# EAGLE design 07_LOAD (EAGLE 7.5.0)
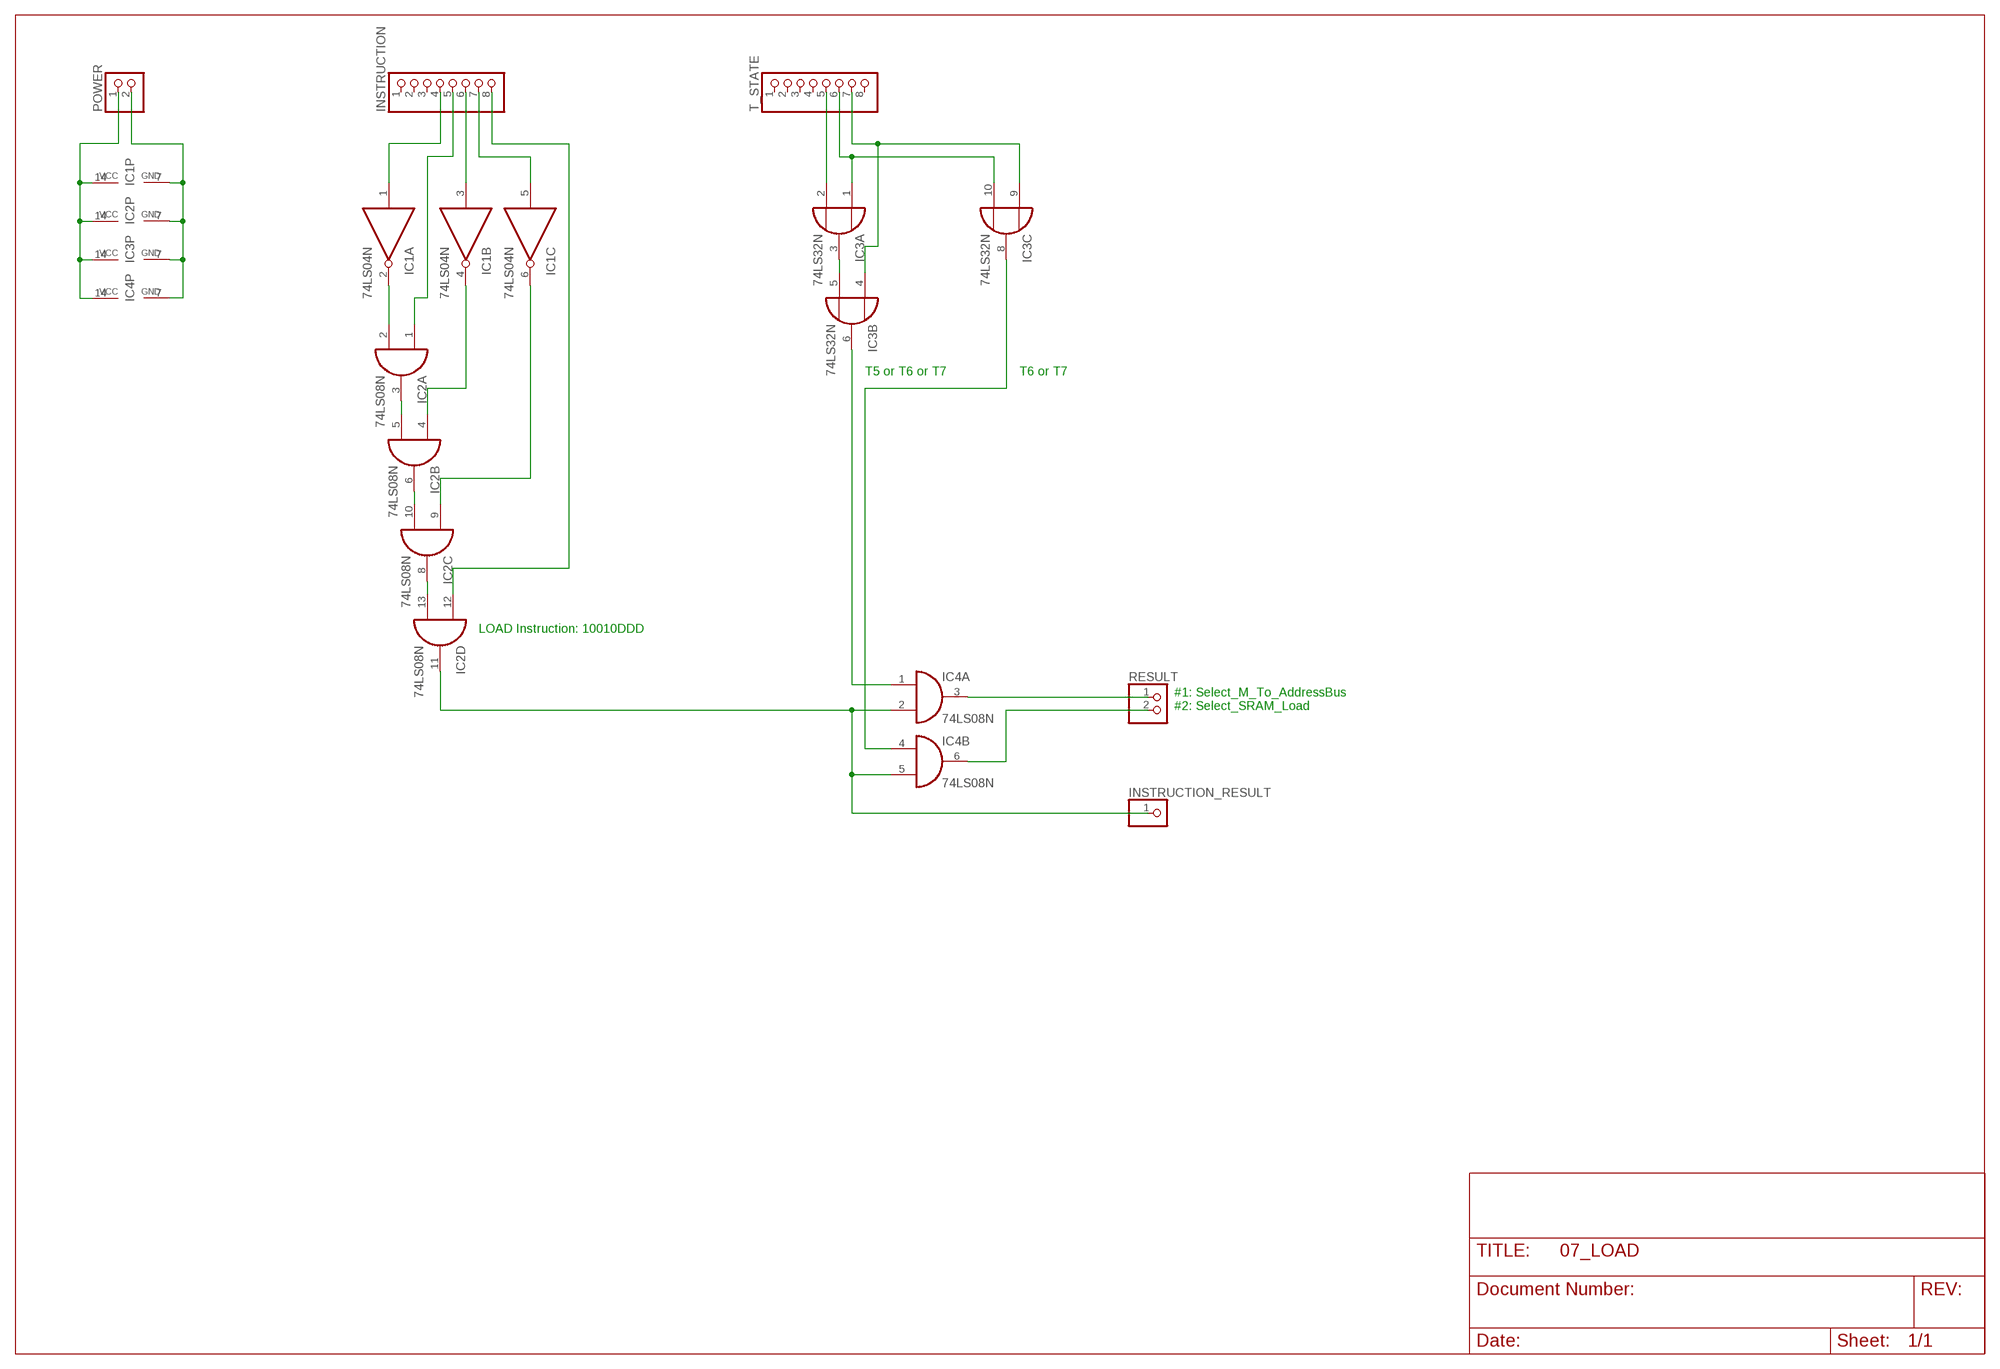
[diagram p0: schematic, sheet 1]

## Parts
IC1  74LS04N  [DIL14]
IC2  74LS08N  [DIL14]
IC3  74LS32N  [DIL14]
IC4  74LS08N  [DIL14]
INSTRUCTION  PINHD-1X8  [1X08]
INSTRUCTION_RESULT  PINHD-1X1  [1X01]
POWER  PINHD-1X2  [1X02]
RESULT  PINHD-1X2  [1X02]
T_STATE  PINHD-1X8  [1X08]

## Nets
GND: IC1.7(P:GND) IC2.7(P:GND) IC3.7(P:GND) IC4.7(P:GND) POWER.2
N$1: IC1.1(A:I) INSTRUCTION.4
N$2: IC1.3(B:I) INSTRUCTION.6
N$3: IC1.5(C:I) INSTRUCTION.7
N$4: IC1.2(A:O) IC2.2(A:I1)
N$5: IC2.1(A:I0) INSTRUCTION.5
N$6: IC2.3(A:O) IC2.5(B:I1)
N$7: IC1.4(B:O) IC2.4(B:I0)
N$8: IC2.6(B:O) IC2.10(C:I1)
N$9: IC1.6(C:O) IC2.9(C:I0)
N$10: IC2.8(C:O) IC2.13(D:I1)
N$11: IC2.12(D:I0) INSTRUCTION.8
N$12: IC3.2(A:I1) T_STATE.5
N$13: IC3.1(A:I0) IC3.10(C:I1) T_STATE.6
N$14: IC3.3(A:O) IC3.5(B:I1)
N$16: IC2.11(D:O) IC4.2(A:I1) IC4.5(B:I1) INSTRUCTION_RESULT.1
N$17: IC3.6(B:O) IC4.1(A:I0)
N$19: IC3.8(C:O) IC4.4(B:I0)
N$20: IC4.6(B:O) RESULT.2
N$22: IC3.4(B:I0) IC3.9(C:I0) T_STATE.7
RESULT: IC4.3(A:O) RESULT.1
VCC: IC1.14(P:VCC) IC2.14(P:VCC) IC3.14(P:VCC) IC4.14(P:VCC) POWER.1
Unconnected: IC1.8(D:O) IC1.9(D:I) IC1.10(E:O) IC1.11(E:I) IC1.12(F:O) IC1.13(F:I) IC3.11(D:O) IC3.12(D:I0) IC3.13(D:I1) IC4.8(C:O) IC4.9(C:I0) IC4.10(C:I1) IC4.11(D:O) IC4.12(D:I0) IC4.13(D:I1) INSTRUCTION.1 INSTRUCTION.2 INSTRUCTION.3 T_STATE.1 T_STATE.2 T_STATE.3 T_STATE.4 T_STATE.8

## Notes on the sheet
- T5 or T6 or T7 | T6 or T7
- LOAD Instruction: 10010DDD
- #1: Select_M_To_AddressBus
  #2: Select_SRAM_Load

## Library data of the parts
IC1 = 74xx-eu:74*04: Hex INVERTER
IC2 IC4 = 74xx-eu:74*08: Quad 2-input AND gate
IC3 = 74xx-eu:74*32: Quad 2-input OR gate
INSTRUCTION T_STATE = pinhead:PINHD-1X8: PIN HEADER
INSTRUCTION_RESULT = pinhead:PINHD-1X1: PIN HEADER
POWER RESULT = pinhead:PINHD-1X2: PIN HEADER

## Board
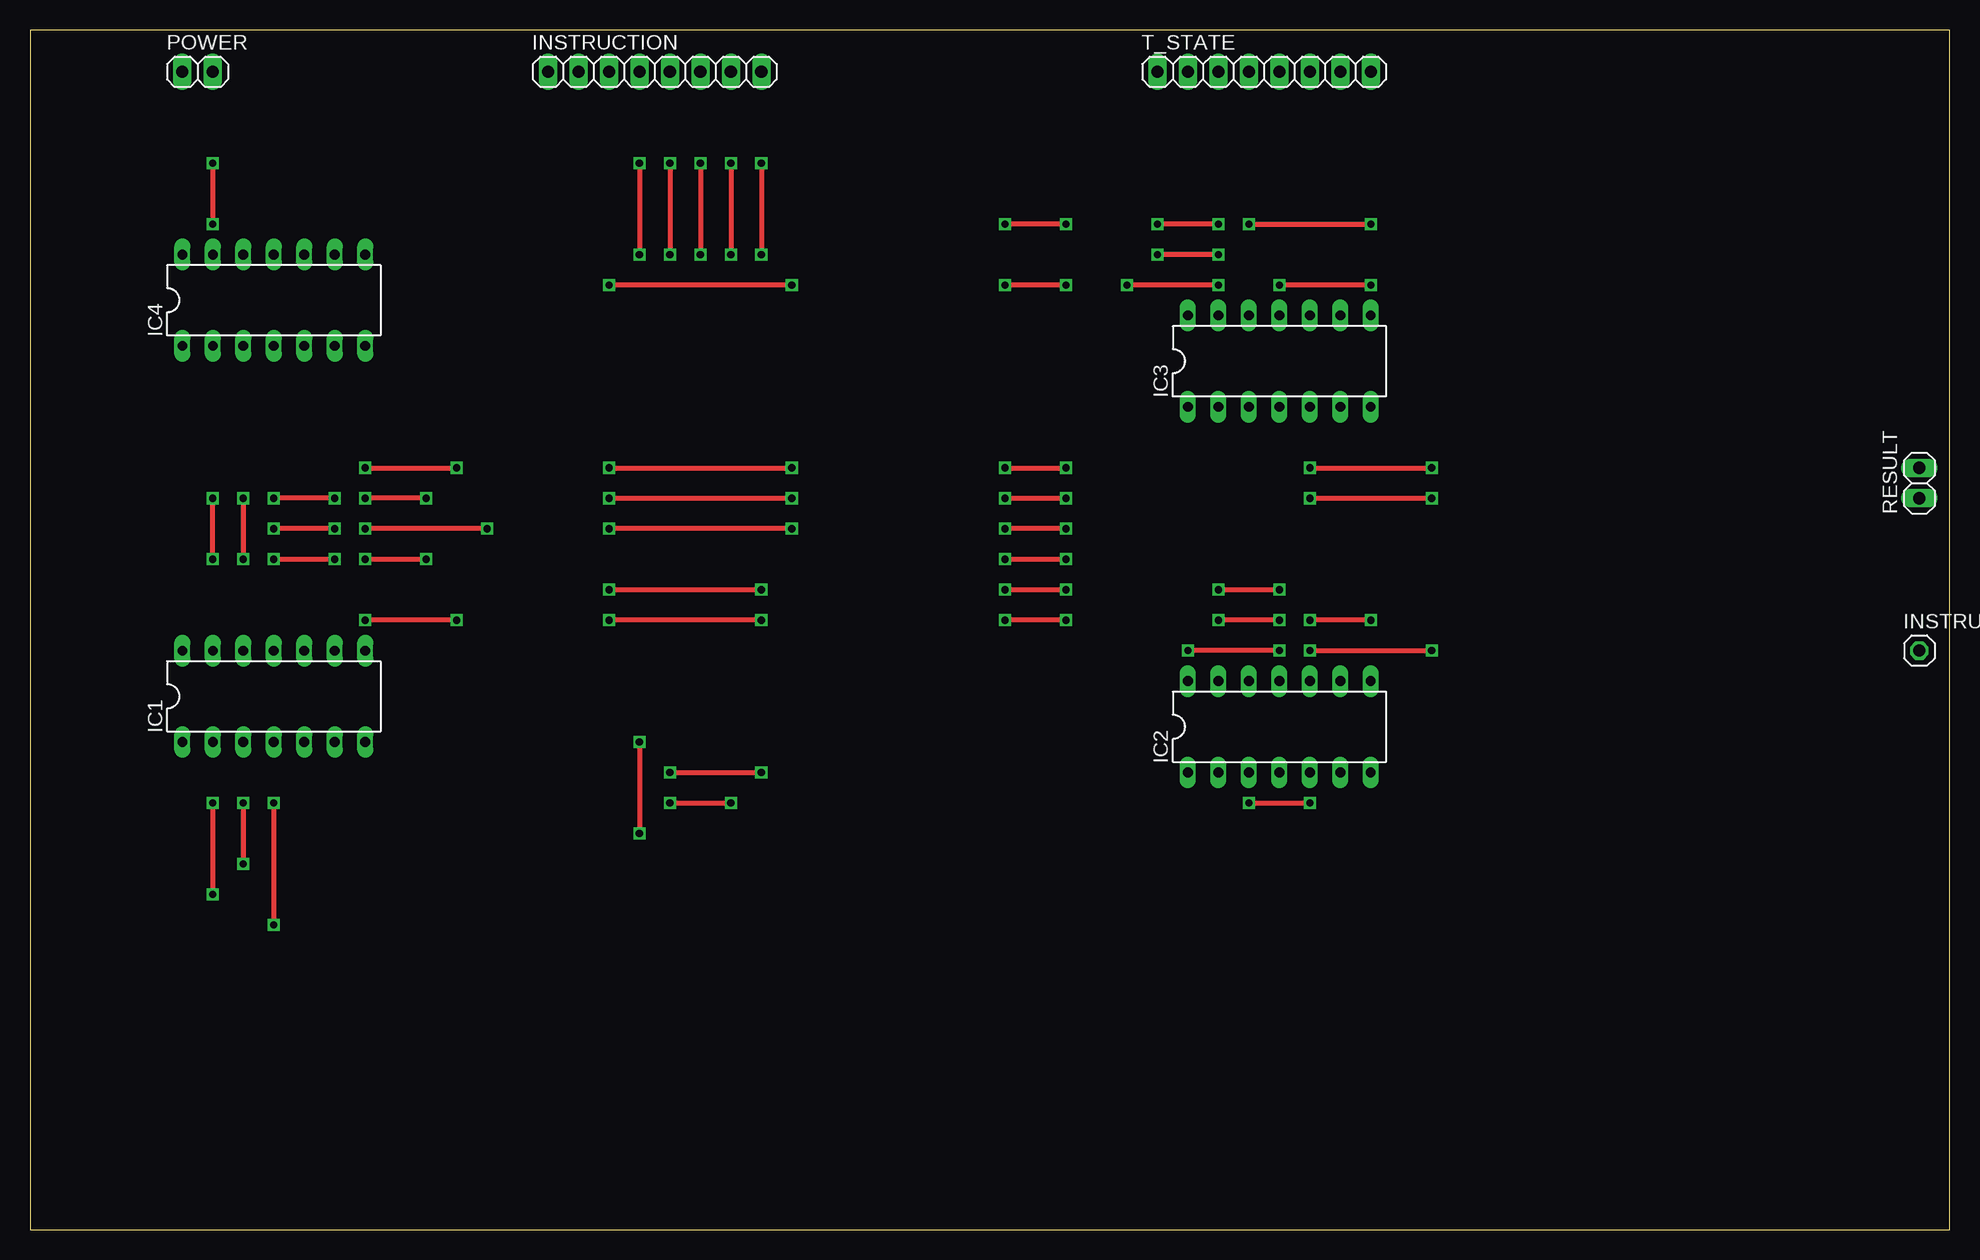
[diagram p1: board, top side]
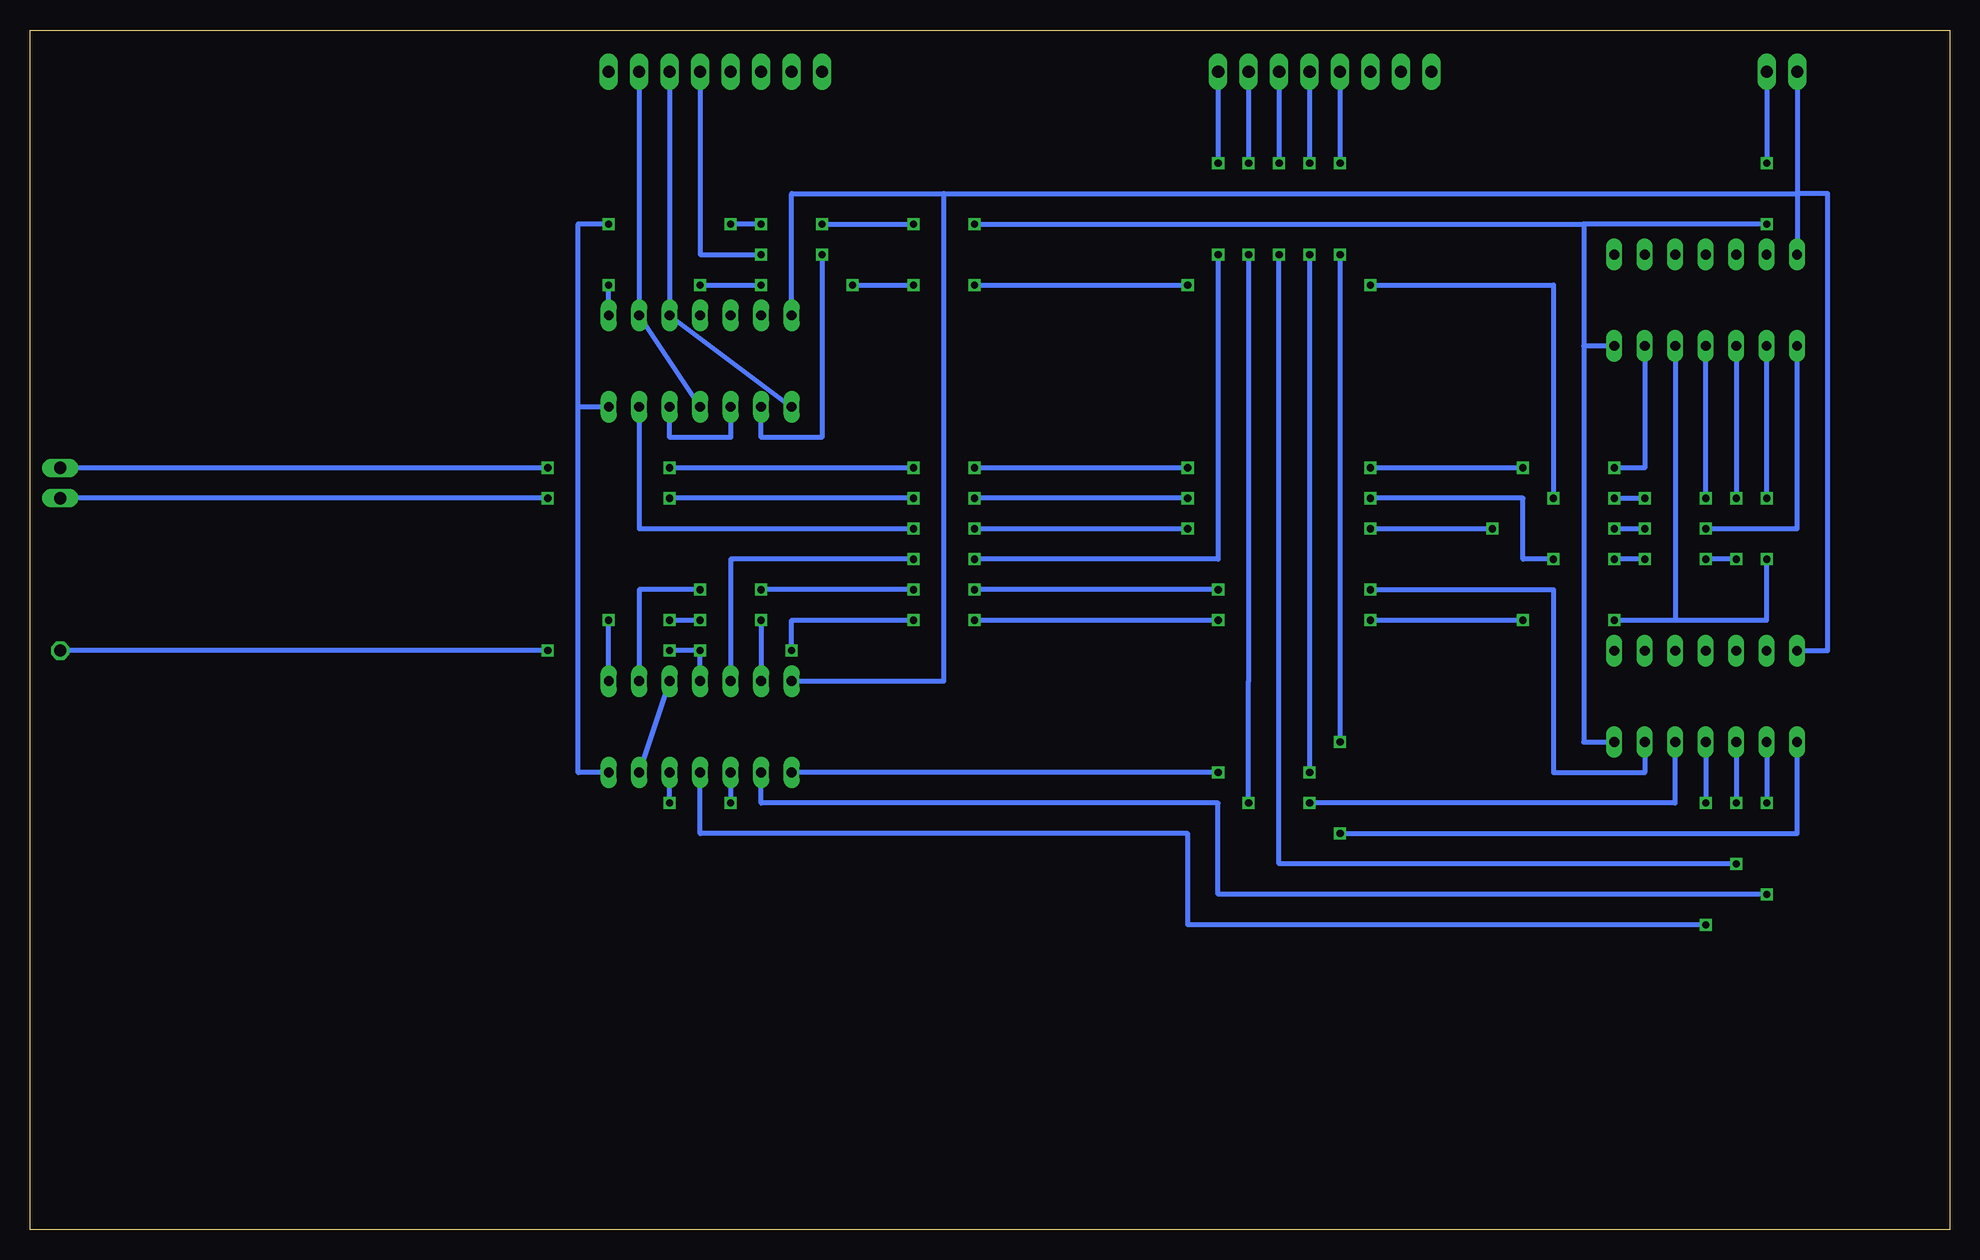
[diagram p2: board, bottom side, seen from below]

Size 160 x 100 mm. Coordinates in mm from the lower left corner, seen from the top.
Outline: 0,0 160,0 160,100 0,100 0,0
Copper layers (1*16): Top 0.035mm / dielectric 1.5mm / Bottom 0.035mm
Design rules "default": minimum track width 10mil, minimum drill 24mil, track to track 8mil, track to pad 8mil, pad to pad 8mil, via to via 8mil, smd to smd 8mil, copper to edge 40mil, drill to drill 8mil, minimum pad ring 10mil, minimum via ring 8mil, stop-mask expansion 4mil, vias tented up to drill 0mil, thermal gap 10mil

### Footprints (pad centres in the part's own frame; a part is rotated, then mirrored left to right if it is on the bottom)
DIL14 = drill 0.813 long: 1 -7.62,-3.81; 2 -5.08,-3.81; 3 -2.54,-3.81; 4 0,-3.81; 5 2.54,-3.81; 6 5.08,-3.81; 7 7.62,-3.81; 8 7.62,3.81; 9 5.08,3.81; 10 2.54,3.81; 11 0,3.81; 12 -2.54,3.81; 13 -5.08,3.81; 14 -7.62,3.81
1X08 = drill 1.016 long: 1 -8.89,0; 2 -6.35,0; 3 -3.81,0; 4 -1.27,0; 5 1.27,0; 6 3.81,0; 7 6.35,0; 8 8.89,0
1X01 = drill 1.016 octagon: 1 0,0
1X02 = drill 1.016 long: 1 -1.27,0; 2 1.27,0

### Placement (x,y rotation side)
IC1  20.32,44.45 0 top
IC2  104.14,41.91 0 top
IC3  104.14,72.39 0 top
IC4  20.32,77.47 0 top
INSTRUCTION  52.07,96.52 0 top
INSTRUCTION_RESULT  157.48,48.26 0 top
POWER  13.97,96.52 0 top
RESULT  157.48,62.23 90 top
T_STATE  102.87,96.52 0 top

### Tracks (layer width: path | path; a pad name or v marks a point on that pad's centre or on a via)
GND  (via drill 0.6)
  Top 0.406: v15.24,88.9 v15.24,83.82 | v99.06,83.82 v93.98,83.82 | v86.36,83.82 v81.28,83.82 | v101.6,83.82 v111.76,83.82
  Bottom 0.406: POWER.2 v15.24,88.9 | v15.24,83.82 30.48,83.82 | 30.48,83.82 30.48,73.66 | 30.48,73.66 30.48,40.64 IC1.7 | IC4.7 30.48,73.66 | IC2.7 114.3,38.1 114.3,68.58 | 114.3,68.58 114.3,83.82 v111.76,83.82 | v93.98,83.82 v86.36,83.82 | v81.28,83.82 30.48,83.82 | IC3.7 114.3,68.58 | v99.06,83.82 v101.6,83.82
N$1  (via drill 0.6)
  Top 0.406: v50.8,88.9 v50.8,81.28 | v50.8,40.64 v50.8,33.02
  Bottom 0.406: INSTRUCTION.4 v50.8,88.9 | v50.8,81.28 v50.8,40.64 | v50.8,33.02 12.7,33.02 IC1.1
N$2  (via drill 0.6)
  Top 0.406: v55.88,88.9 v55.88,81.28 | v17.78,35.56 v17.78,30.48
  Bottom 0.406: INSTRUCTION.6 v55.88,88.9 | IC1.3 v17.78,35.56 | v17.78,30.48 55.88,30.48 v55.88,81.28
N$3  (via drill 0.6)
  Top 0.406: v58.42,88.9 v58.42,81.28 | v53.34,35.56 v58.42,35.56
  Bottom 0.406: INSTRUCTION.7 v58.42,88.9 | v58.42,81.28 58.42,45.72 v58.42,35.56 | IC1.5 22.86,35.56 v53.34,35.56
N$4  (via drill 0.6)
  Top 0.406: v15.24,35.56 v15.24,27.94
  Bottom 0.406: IC1.2 v15.24,35.56 | v15.24,27.94 60.96,27.94 60.96,35.56 99.06,35.56 IC2.2
N$5  (via drill 0.6)
  Top 0.406: v53.34,88.9 v53.34,81.28 | v53.34,38.1 v60.96,38.1
  Bottom 0.406: INSTRUCTION.5 v53.34,88.9 | v53.34,81.28 v53.34,38.1 | v60.96,38.1 IC2.1
N$6  (via drill 0.6)
  Top 0.406: v101.6,35.56 v106.68,35.56
  Bottom 0.406: IC2.3 v101.6,35.56 | v106.68,35.56 IC2.5
N$7  (via drill 0.6)
  Top 0.406: v20.32,35.56 v20.32,25.4
  Bottom 0.406: IC1.4 v20.32,35.56 | v20.32,25.4 63.5,25.4 63.5,33.02 104.14,33.02 IC2.4
N$8
  Bottom 0.406: IC2.10 IC2.6
N$9  (via drill 0.6)
  Top 0.406: v48.26,53.34 v60.96,53.34 | v81.28,53.34 v86.36,53.34 | v99.06,53.34 v104.14,53.34
  Bottom 0.406: IC1.6 25.4,38.1 33.02,38.1 33.02,53.34 v48.26,53.34 | v60.96,53.34 v81.28,53.34 | v86.36,53.34 v99.06,53.34 | v104.14,53.34 109.22,53.34 IC2.9
N$10  (via drill 0.6)
  Top 0.406: v111.76,50.8 v106.68,50.8 | v104.14,50.8 v99.06,50.8
  Bottom 0.406: IC2.8 v111.76,50.8 | v106.68,50.8 v104.14,50.8 | v99.06,50.8 IC2.13
N$11  (via drill 0.6)
  Top 0.406: v60.96,88.9 v60.96,81.28 | v81.28,55.88 v86.36,55.88
  Bottom 0.406: INSTRUCTION.8 v60.96,88.9 | v60.96,81.28 60.96,55.88 v81.28,55.88 | v86.36,55.88 101.6,55.88 IC2.12
N$12  (via drill 0.6)
  Top 0.406: v99.06,81.28 v93.98,81.28
  Bottom 0.406: T_STATE.5 104.14,81.28 v99.06,81.28 | v93.98,81.28 93.98,66.04 99.06,66.04 IC3.2
N$13
  Bottom 0.406: T_STATE.6 IC3.10 IC3.1
N$14
  Bottom 0.406: IC3.3 101.6,66.04 106.68,66.04 IC3.5
N$16  (via drill 0.6)
  Top 0.406: v104.14,48.26 v96.52,48.26 | v86.36,50.8 v81.28,50.8 | v60.96,50.8 v48.26,50.8 | v35.56,50.8 v27.94,50.8 | v15.24,55.88 v15.24,60.96 | v106.68,48.26 v116.84,48.26
  Bottom 0.406: IC2.11 v104.14,48.26 v106.68,48.26 | v81.28,50.8 v60.96,50.8 | v48.26,50.8 v35.56,50.8 | v27.94,50.8 22.86,50.8 | 22.86,50.8 15.24,50.8 v15.24,55.88 | v15.24,60.96 IC4.2 | v116.84,48.26 INSTRUCTION_RESULT.1 | v96.52,48.26 96.52,50.8 v86.36,50.8 | IC4.5 22.86,50.8
N$17  (via drill 0.6)
  Top 0.406: v86.36,58.42 v81.28,58.42 | v63.5,58.42 v48.26,58.42 | v38.1,58.42 v27.94,58.42 | v25.4,58.42 v20.32,58.42
  Bottom 0.406: IC3.6 109.22,58.42 v86.36,58.42 | v81.28,58.42 v63.5,58.42 | v48.26,58.42 v38.1,58.42 | IC4.1 12.7,58.42 v20.32,58.42 | v27.94,58.42 v25.4,58.42
N$19  (via drill 0.6)
  Top 0.406: v111.76,78.74 v104.14,78.74 | v99.06,78.74 v91.44,78.74 | v86.36,78.74 v81.28,78.74 | v63.5,78.74 v48.26,78.74 | v33.02,60.96 v27.94,60.96 | v25.4,60.96 v20.32,60.96
  Bottom 0.406: IC3.8 v111.76,78.74 | v104.14,78.74 v99.06,78.74 | v91.44,78.74 v86.36,78.74 | v81.28,78.74 v63.5,78.74 | v48.26,78.74 33.02,78.74 v33.02,60.96 | IC4.4 20.32,63.5 v20.32,60.96 | v27.94,60.96 v25.4,60.96
N$20  (via drill 0.6)
  Top 0.406: v27.94,63.5 v35.56,63.5 | v48.26,63.5 v63.5,63.5 | v81.28,63.5 v86.36,63.5 | v106.68,63.5 v116.84,63.5
  Bottom 0.406: IC4.6 25.4,63.5 v27.94,63.5 | v35.56,63.5 v48.26,63.5 | v63.5,63.5 v81.28,63.5 | v86.36,63.5 v106.68,63.5 | v116.84,63.5 RESULT.2
N$22
  Bottom 0.406: T_STATE.7 IC3.9 IC3.4
RESULT  (via drill 0.6)
  Top 0.406: v17.78,60.96 v17.78,55.88 | v20.32,55.88 v25.4,55.88 | v27.94,55.88 v33.02,55.88 | v48.26,60.96 v63.5,60.96 | v81.28,60.96 v86.36,60.96 | v106.68,60.96 v116.84,60.96
  Bottom 0.406: IC4.3 v17.78,60.96 | v17.78,55.88 v20.32,55.88 | v25.4,55.88 v27.94,55.88 | v33.02,55.88 35.56,55.88 35.56,60.96 v48.26,60.96 | v63.5,60.96 v81.28,60.96 | v86.36,60.96 v106.68,60.96 | v116.84,60.96 RESULT.1
VCC
  Bottom 0.406: POWER.1 12.7,86.36 | 12.7,86.36 IC4.14 | IC1.14 10.16,48.26 10.16,86.36 12.7,86.36 | IC3.14 96.52,86.36 83.82,86.36 | 83.82,86.36 12.7,86.36 | IC2.14 83.82,45.72 83.82,86.36